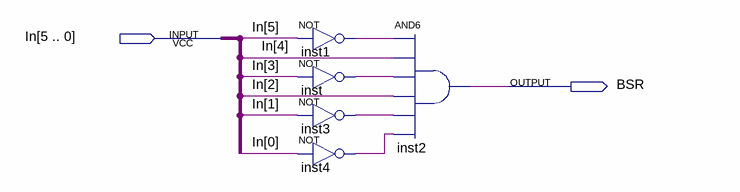
[diagram p0: schematic sheet]
// Quartus schematic ON_4_BSR.bdf as structural Verilog: 5 symbols, 2 pins
module ON_4_BSR (
  input  [5:0] In,
  output BSR
);

  wire inst1_out, inst3_out, inst4_out, inst_out;

  not inst1 (inst1_out, In[5]);
  not inst (inst_out, In[3]);
  not inst3 (inst3_out, In[1]);
  not inst4 (inst4_out, In[0]);
  and inst2 (BSR, inst1_out, In[4], inst_out, In[2], inst3_out, inst4_out);
endmodule
